# Altium schematic sheet MCU.SchDoc
size A4
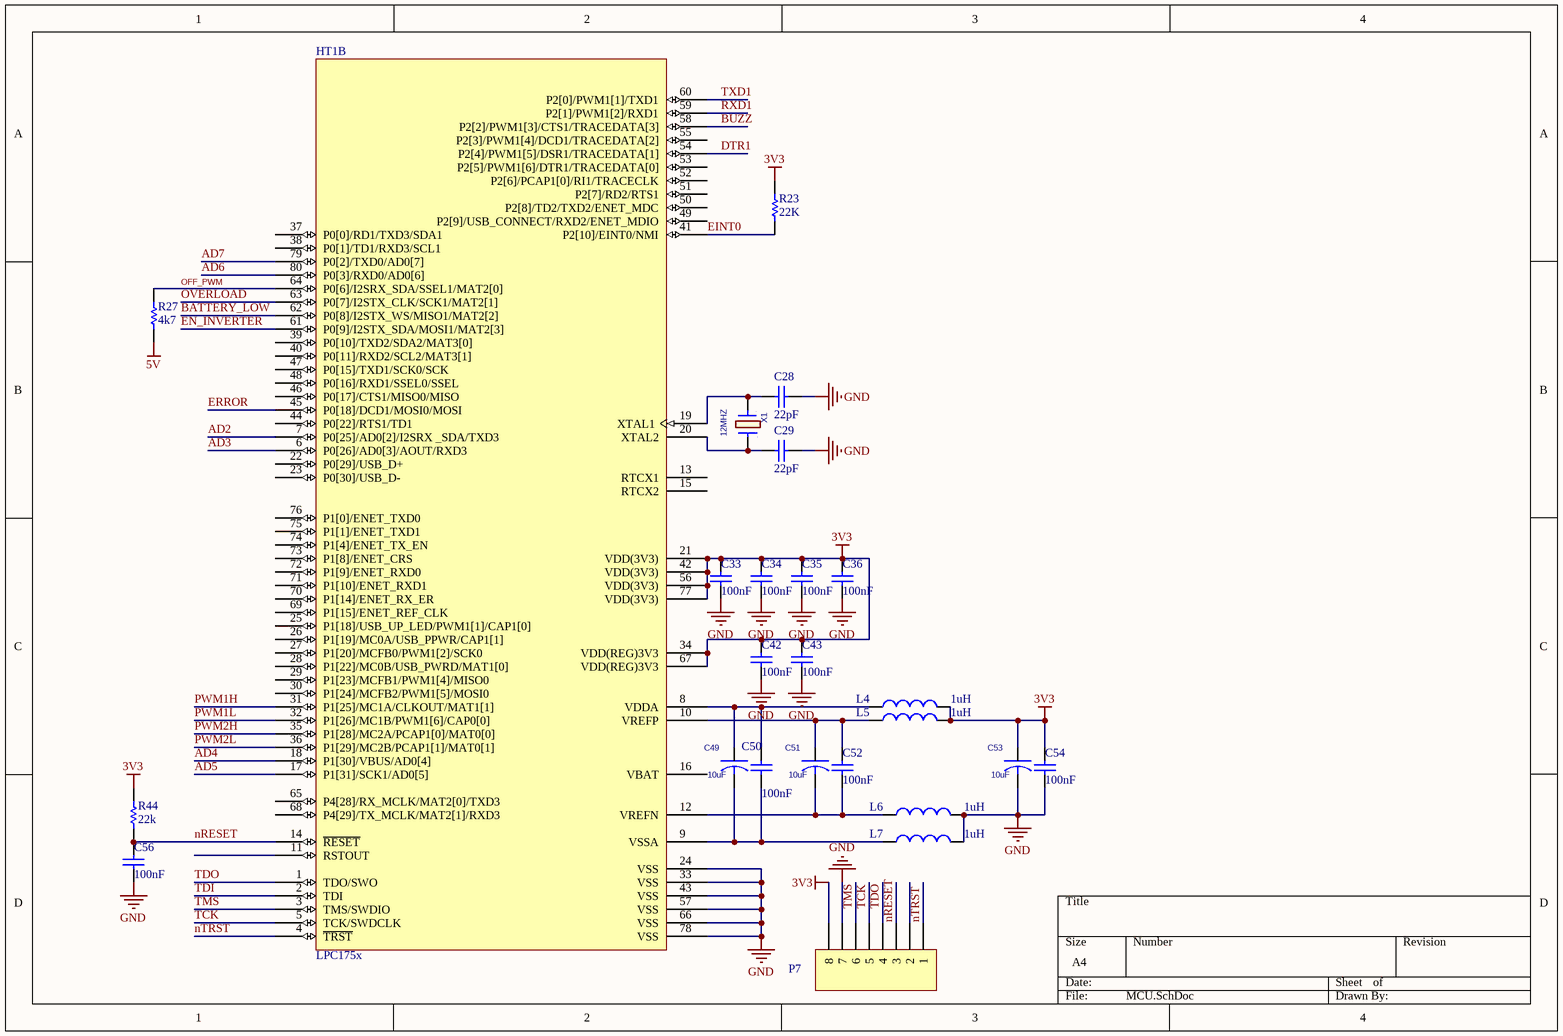
[diagram p0: MCU.SchDoc]

## Parts
C28  value 22pF  [C0805]  (hidden comment: CX4)
C29  value 22pF  [C0805]  (hidden comment: CX4)
C33  value 100nF  [C0805]  (hidden comment: CX4)
C34  value 100nF  [C0805]  (hidden comment: CX4)
C35  value 100nF  [C0805]  (hidden comment: CX4)
C36  value 100nF  [C0805]  (hidden comment: CX4)
C42  value 100nF  [C0805]  (hidden comment: CX4)
C43  value 100nF  [C0805]  (hidden comment: CX4)
C49  10uF  [CAP_10uF_SMD]
C50  value 100nF  [C0805]  (hidden comment: CX4)
C51  10uF  [CAP_10uF_SMD]
C52  value 100nF  [C0805]  (hidden comment: CX4)
C53  10uF  [CAP_10uF_SMD]
C54  value 100nF  [C0805]  (hidden comment: CX4)
C56  value 100nF  [C0805]  (hidden comment: CX4)
HT1  LPC175x  [PCBComponent_1 - duplicate]  (part B of 2)
L4  value 1uH  [L_1uH]  (hidden comment: Inductor)
L5  value 1uH  [L_1uH]  (hidden comment: Inductor)
L6  value 1uH  [L_1uH]  (hidden comment: Inductor)
L7  value 1uH  [L_1uH]  (hidden comment: Inductor)
P7  Header 8  [HDR1X8]  (value not drawn)
R23  value 22K  [R0805]  (hidden comment: Resistor SMD0805)
R27  value 4k7  [R0805]  (hidden comment: Resistor SMD0805)
R44  value 22k  [R0805]  (hidden comment: Resistor SMD0805)
X1  12MHZ  [CRYSTAL_12Mhz]

## Nets
3V3: C33.2 C34.2 C35.2 C36.2 C42.2 C43.2 C53.1 C54.2 HT1.21(VDD(3V3)) HT1.34(VDD(REG)3V3) HT1.42(VDD(3V3)) HT1.56(VDD(3V3)) HT1.67(VDD(REG)3V3) HT1.77(VDD(3V3)) L4.2 L5.2 P7.8 R23.2 R44.2
5V: R27.1
GND: C28.1 C29.1 C33.1 C34.1 C35.1 C36.1 C42.1 C43.1 C53.2 C54.1 C56.1 HT1.24(VSS) HT1.33(VSS) HT1.43(VSS) HT1.57(VSS) HT1.66(VSS) HT1.78(VSS) L6.2 L7.2 P7.7
AD2: HT1.7(P0[25]/AD0[2]/I2SRX__SDA/TXD3)
AD3: HT1.6(P0[26]/AD0[3]/AOUT/RXD3)
AD4: HT1.18(P1[30]/VBUS/AD0[4])
AD5: HT1.17(P1[31]/SCK1/AD0[5])
AD6: HT1.80(P0[3]/RXD0/AD0[6])
AD7: HT1.79(P0[2]/TXD0/AD0[7])
BATTERY_LOW: HT1.62(P0[8]/I2STX_WS/MISO1/MAT2[2])
BUZZ: HT1.58(P2[2]/PWM1[3]/CTS1/TRACEDATA[3])
DTR1: HT1.54(P2[4]/PWM1[5]/DSR1/TRACEDATA[1])
EINT0: HT1.41(P2[10]/EINT0/NMI) R23.1
EN_INVERTER: HT1.61(P0[9]/I2STX_SDA/MOSI1/MAT2[3])
ERROR: HT1.45(P0[18]/DCD1/MOSI0/MOSI)
nRESET: C56.2 HT1.14(~{RESET}) P7.3 R44.1
nTRST: HT1.4(~{TRST}) P7.1
OFF_PWM: HT1.64(P0[6]/I2SRX_SDA/SSEL1/MAT2[0]) R27.2
OVERLOAD: HT1.63(P0[7]/I2STX_CLK/SCK1/MAT2[1])
PWM1H: HT1.31(P1[25]/MC1A/CLKOUT/MAT1[1])
PWM1L: HT1.32(P1[26]/MC1B/PWM1[6]/CAP0[0])
PWM2H: HT1.35(P1[28]/MC2A/PCAP1[0]/MAT0[0])
PWM2L: HT1.36(P1[29]/MC2B/PCAP1[1]/MAT0[1])
RXD1: HT1.59(P2[1]/PWM1[2]/RXD1)
TCK: HT1.5(TCK/SWDCLK) P7.5
TDI: HT1.2(TDI)
TDO: HT1.1(TDO/SWO) P7.4
TMS: HT1.3(TMS/SWDIO) P7.6
TXD1: HT1.60(P2[0]/PWM1[1]/TXD1)
NetC28_2: C28.2 HT1.19(XTAL1) X1.1
NetC29_2: C29.2 HT1.20(XTAL2) X1.2
NetC49_1: C49.1 C50.2 HT1.8(VDDA) L4.1
NetC49_2: C49.2 C50.1 HT1.9(VSSA) L7.1
NetC51_1: C51.1 C52.2 HT1.10(VREFP) L5.1
NetC51_2: C51.2 C52.1 HT1.12(VREFN) L6.1

Not connected (* = marked no-connect by the designer): HT1 11(RSTOUT) 13(RTCX1) 15(RTCX2) 16(VBAT) 22(P0[29]/USB_D+) 23(P0[30]/USB_D-) 25(P1[18]/USB_UP_LED/PWM1[1]/CAP1[0]) 26(P1[19]/MC0A/USB_PPWR/CAP1[1]) 27(P1[20]/MCFB0/PWM1[2]/SCK0) 28(P1[22]/MC0B/USB_PWRD/MAT1[0]) 29(P1[23]/MCFB1/PWM1[4]/MISO0) 30(P1[24]/MCFB2/PWM1[5]/MOSI0) 37(P0[0]/RD1/TXD3/SDA1) 38(P0[1]/TD1/RXD3/SCL1) 39(P0[10]/TXD2/SDA2/MAT3[0]) 40(P0[11]/RXD2/SCL2/MAT3[1]) 44(P0[22]/RTS1/TD1) 46(P0[17]/CTS1/MISO0/MISO) 47(P0[15]/TXD1/SCK0/SCK) 48(P0[16]/RXD1/SSEL0/SSEL) 49(P2[9]/USB_CONNECT/RXD2/ENET_MDIO) 50(P2[8]/TD2/TXD2/ENET_MDC) 51(P2[7]/RD2/RTS1) 52(P2[6]/PCAP1[0]/RI1/TRACECLK) 53(P2[5]/PWM1[6]/DTR1/TRACEDATA[0]) 55(P2[3]/PWM1[4]/DCD1/TRACEDATA[2]) 65(P4[28]/RX_MCLK/MAT2[0]/TXD3) 68(P4[29]/TX_MCLK/MAT2[1]/RXD3) 69(P1[15]/ENET_REF_CLK) 70(P1[14]/ENET_RX_ER) 71(P1[10]/ENET_RXD1) 72(P1[9]/ENET_RXD0) 73(P1[8]/ENET_CRS) 74(P1[4]/ENET_TX_EN) 75(P1[1]/ENET_TXD1) 76(P1[0]/ENET_TXD0); P7 2

## Library data of the parts
C28 C29 C33-C36 C42 C43 C50 C52 C54 C56 = Cap: Capacitor Type 0805 SMD; Published: 8-Jun-2000; LatestRevisionDate: 17-Jul-2002; LatestRevisionNote: Re-released for DXP Platform.; PackageReference: RAD-0.3; Publisher: Altium Limited
C49 C51 C53 = C
L4-L7 = Inductor: Inductor Type 1206 SMD; Code_IEC: 1005; Published: 8-Jun-2000; LatestRevisionDate: 29-May-2009; LatestRevisionNote: IPC-7351 Footprint Added.; PackageReference: 0402-A; Publisher: Altium Limited; PackageDescription: Chip Inductor; Code_JEITA: 0402
P7 = Header 8: Header, 8-Pin; LatestRevisionDate: 17-Jul-2002; LatestRevisionNote: Re-released for DXP Platform.; Publisher: Altium Limited
R23 R27 R44 = Res1: Published: 8-Jun-2000; LatestRevisionDate: 17-Jul-2002; LatestRevisionNote: Re-released for DXP Platform.; PackageReference: AXIAL-0.3; Publisher: Altium Limited
X1 = QZS10MEG_0: Thach anh 12MHZ; PSpiceTemplate: X^@REFDES %1 %2 @MODEL; COMPHEIGHT: 0.000; MEMORY: NO; COMPGROUP: 0; COMPROT: 270; COMPLOC: [2683.000,1678.000]; COMPSIDE: TOP; DECOUPLER: NO; COMPKEY: NO; COMPLOCKED: NO; COMPFIXED: NO